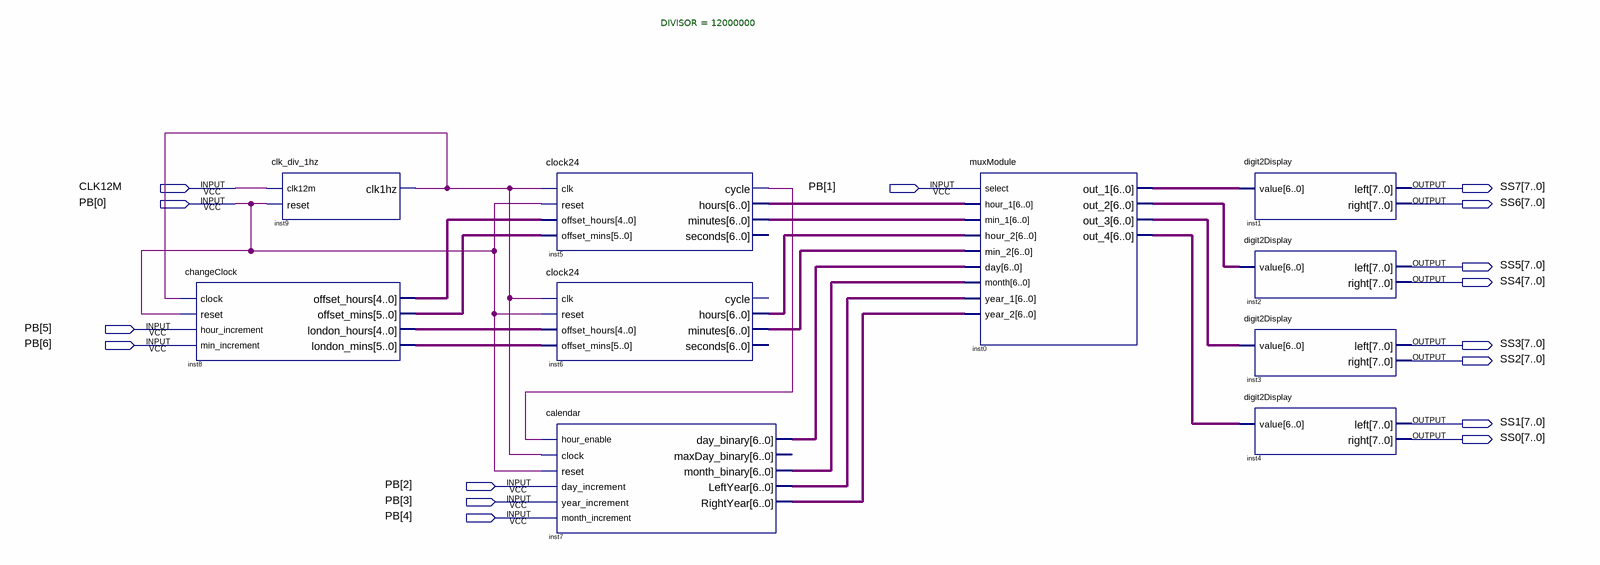
[diagram p0: schematic sheet]
// Quartus schematic worldClock2.bdf as structural Verilog: 10 symbols, 16 pins
module worldClock2 (
  input  CLK12M,
  input  [6:0] PB,
  output [7:0] SS7,
  output [7:0] SS6,
  output [7:0] SS5,
  output [7:0] SS4,
  output [7:0] SS3,
  output [7:0] SS2,
  output [7:0] SS1,
  output [7:0] SS0
);

  wire inst5_cycle, inst9_clk1hz;
  wire [4:0] inst8_london_hours, inst8_offset_hours;
  wire [5:0] inst8_london_mins, inst8_offset_mins;
  wire [6:0] inst0_out_1, inst0_out_2, inst0_out_3, inst0_out_4, inst5_hours, inst5_minutes, inst6_hours,
       inst6_minutes, inst7_day_binary, inst7_leftyear, inst7_month_binary, inst7_rightyear;

  changeClock inst8 (
    .clock(inst9_clk1hz), .reset(PB[0]), .hour_increment(PB[5]), .min_increment(PB[6]),
    .offset_hours(inst8_offset_hours), .offset_mins(inst8_offset_mins), .london_hours(inst8_london_hours),
    .london_mins(inst8_london_mins));
  clk_div_1hz #(.DIVISOR(12000000)) inst9 (.clk12m(CLK12M), .reset(PB[0]), .clk1hz(inst9_clk1hz));
  clock24 inst5 (
    .clk(inst9_clk1hz), .reset(PB[0]), .offset_hours(inst8_offset_hours), .offset_mins(inst8_offset_mins),
    .cycle(inst5_cycle), .hours(inst5_hours), .minutes(inst5_minutes));  // open: seconds
  clock24 inst6 (
    .clk(inst9_clk1hz), .reset(PB[0]), .offset_hours(inst8_london_hours), .offset_mins(inst8_london_mins),
    .hours(inst6_hours), .minutes(inst6_minutes));  // open: cycle, seconds
  calendar inst7 (
    .hour_enable(inst5_cycle), .clock(inst9_clk1hz), .reset(PB[0]), .day_increment(PB[2]),
    .year_increment(PB[3]), .month_increment(PB[4]), .day_binary(inst7_day_binary),
    .month_binary(inst7_month_binary), .LeftYear(inst7_leftyear), .RightYear(inst7_rightyear));  // open: maxDay_binary
  muxModule inst0 (
    .select(PB[1]), .hour_1(inst5_hours), .min_1(inst5_minutes), .hour_2(inst6_hours), .min_2(inst6_minutes),
    .day(inst7_day_binary), .month(inst7_month_binary), .year_1(inst7_leftyear), .year_2(inst7_rightyear),
    .out_1(inst0_out_1), .out_2(inst0_out_2), .out_3(inst0_out_3), .out_4(inst0_out_4));
  digit2Display inst1 (.value(inst0_out_1), .left(SS7), .right(SS6));
  digit2Display inst2 (.value(inst0_out_2), .left(SS5), .right(SS4));
  digit2Display inst3 (.value(inst0_out_3), .left(SS3), .right(SS2));
  digit2Display inst4 (.value(inst0_out_4), .left(SS1), .right(SS0));
endmodule
